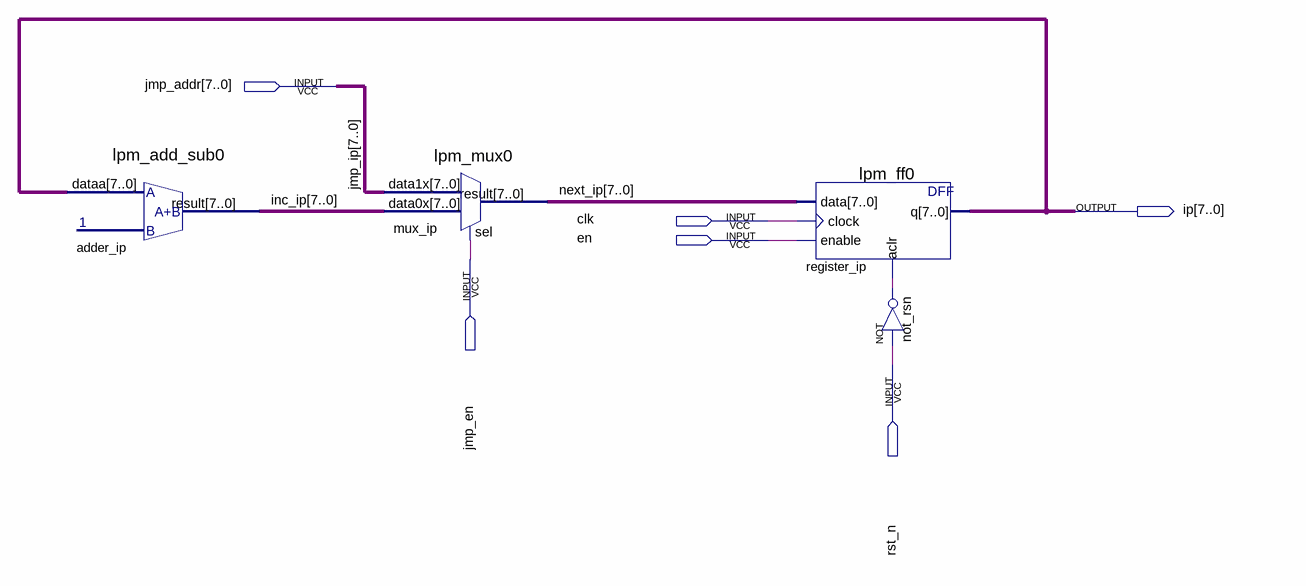
[diagram p0: schematic sheet]
// Quartus schematic ip_unit.bdf as structural Verilog: 4 symbols, 6 pins
module ip_unit (
  input  [7:0] jmp_addr,
  input  clk,
  input  en,
  input  jmp_en,
  input  rst_n,
  output [7:0] ip
);

  wire not_rsn_out;
  wire [7:0] inc_ip, next_ip;

  lpm_add_sub0 adder_ip (.dataa(ip), .result(inc_ip));
  lpm_mux0 mux_ip (.data1x(jmp_addr), .data0x(inc_ip), .sel(jmp_en), .result(next_ip));
  lpm_ff0 register_ip (.data(next_ip), .clock(clk), .enable(en), .aclr(not_rsn_out), .q(ip));
  not not_rsn (not_rsn_out, rst_n);

  // Other names for the same wires on the sheet: jmp_ip[7:0] = jmp_addr
endmodule
